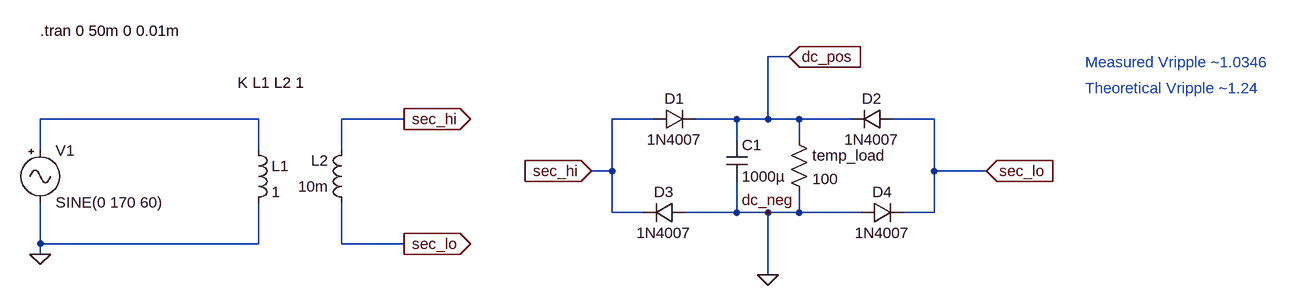
[diagram p0: schematic AC-DC_power_supply_with_ripple_analysis.asc]
AC-DC_power_supply_with_ripple_analysis.asc, the LTspice schematic file:
Version 4.1
SHEET 1 1956 680
WIRE 1184 -16 1152 -16
WIRE 368 80 32 80
WIRE 592 80 496 80
WIRE 976 80 912 80
WIRE 1104 80 1040 80
WIRE 1152 80 1152 -16
WIRE 1152 80 1104 80
WIRE 1200 80 1152 80
WIRE 1280 80 1200 80
WIRE 1408 80 1344 80
WIRE 1104 112 1104 80
WIRE 1200 112 1200 80
WIRE 32 128 32 80
WIRE 368 128 368 80
WIRE 496 128 496 80
WIRE 912 160 912 80
WIRE 912 160 880 160
WIRE 1408 160 1408 80
WIRE 1488 160 1408 160
WIRE 912 224 912 160
WIRE 960 224 912 224
WIRE 1104 224 1104 176
WIRE 1104 224 1024 224
WIRE 1152 224 1104 224
WIRE 1200 224 1200 192
WIRE 1200 224 1152 224
WIRE 1296 224 1200 224
WIRE 1408 224 1408 160
WIRE 1408 224 1360 224
WIRE 32 272 32 208
WIRE 368 272 368 208
WIRE 368 272 32 272
WIRE 496 272 496 208
WIRE 592 272 496 272
WIRE 32 288 32 272
WIRE 1152 320 1152 224
FLAG 32 288 0
FLAG 592 80 sec_hi
IOPIN 592 80 Out
FLAG 592 272 sec_lo
IOPIN 592 272 Out
FLAG 880 160 sec_hi
IOPIN 880 160 In
FLAG 1488 160 sec_lo
IOPIN 1488 160 In
FLAG 1184 -16 dc_pos
IOPIN 1184 -16 In
FLAG 1152 224 dc_neg
FLAG 1152 320 0
SYMBOL Misc\\signal 32 112 R0
WINDOW 123 0 0 Left 0
WINDOW 39 0 0 Left 0
SYMATTR InstName V1
SYMATTR Value SINE(0 170 60)
SYMBOL ind 352 112 R0
SYMATTR InstName L1
SYMATTR Value 1
SYMATTR Type ind
SYMATTR SpiceLine Rser=1m
SYMBOL ind 512 224 R180
WINDOW 0 36 80 Left 2
WINDOW 3 36 40 Left 2
SYMATTR InstName L2
SYMATTR Value 10m
SYMATTR Type ind
SYMATTR SpiceLine Rser=1m
SYMBOL diode 976 96 R270
WINDOW 0 32 32 VTop 2
WINDOW 3 0 32 VBottom 2
SYMATTR InstName D1
SYMATTR Value 1N4007
SYMBOL diode 1344 64 R90
WINDOW 0 0 32 VBottom 2
WINDOW 3 32 32 VTop 2
SYMATTR InstName D2
SYMATTR Value 1N4007
SYMBOL diode 1024 208 R90
WINDOW 0 0 32 VBottom 2
WINDOW 3 32 32 VTop 2
SYMATTR InstName D3
SYMATTR Value 1N4007
SYMBOL diode 1296 240 R270
WINDOW 0 32 32 VTop 2
WINDOW 3 0 32 VBottom 2
SYMATTR InstName D4
SYMATTR Value 1N4007
SYMBOL res 1184 96 R0
SYMATTR InstName temp_load
SYMATTR Value 100
SYMBOL cap 1088 112 R0
SYMATTR InstName C1
SYMATTR Value 1000µ
TEXT 336 24 Left 2 !K L1 L2 1
TEXT 32 -56 Left 2 !.tran 0 50m 0 0.01m
TEXT 1640 -8 Left 2 ;Measured Vripple ~1.0346
TEXT 1640 32 Left 2 ;Theoretical Vripple ~1.24

The netlist it stands for:
* AC-DC_power_supply_with_ripple_analysis.asc
V1 N001 0 SINE(0 170 60)
L1 N001 0 1 Rser=1m
L2 sec_lo sec_hi 10m Rser=1m
D1 sec_hi dc_pos 1N4007
D2 sec_lo dc_pos 1N4007
D3 0 sec_hi 1N4007
D4 0 sec_lo 1N4007
R§temp_load dc_pos 0 100
C1 dc_pos 0 1000µ
.model D D
.lib standard.dio
K L1 L2 1
.tran 0 50m 0 0.01m
* Measured Vripple ~1.0346
* Theoretical Vripple ~1.24
.backanno
.end